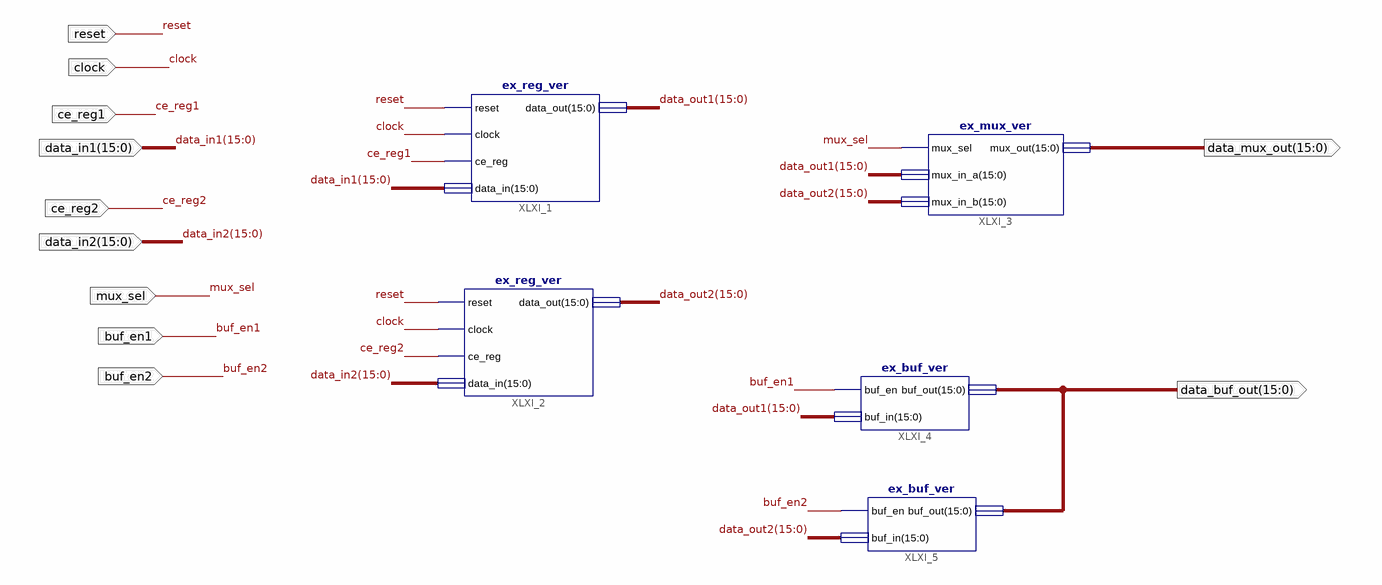
[diagram p0: schematic sheet 1]
// Xilinx ISE schematic ex_top_sch.sch (spartan6) as structural Verilog: 5 symbols, 11 ports
module ex_top_sch (
  input  reset,
  input  clock,
  input  ce_reg1,
  input  ce_reg2,
  input  [15:0] data_in1,
  input  [15:0] data_in2,
  input  mux_sel,
  input  buf_en1,
  input  buf_en2,
  output [15:0] data_mux_out,
  output [15:0] data_buf_out
);

  wire [15:0] data_out1, data_out2;

  ex_buf_ver XLXI_5 (.buf_en(buf_en2), .buf_in(data_out2), .buf_out(data_buf_out));
  ex_buf_ver XLXI_4 (.buf_en(buf_en1), .buf_in(data_out1), .buf_out(data_buf_out));
  ex_mux_ver XLXI_3 (.mux_sel(mux_sel), .mux_in_a(data_out1), .mux_in_b(data_out2), .mux_out(data_mux_out));
  ex_reg_ver XLXI_2 (.reset(reset), .clock(clock), .ce_reg(ce_reg2), .data_in(data_in2), .data_out(data_out2));
  ex_reg_ver XLXI_1 (.reset(reset), .clock(clock), .ce_reg(ce_reg1), .data_in(data_in1), .data_out(data_out1));
endmodule
